# EAGLE design maplemini-r2 (EAGLE 5.11)
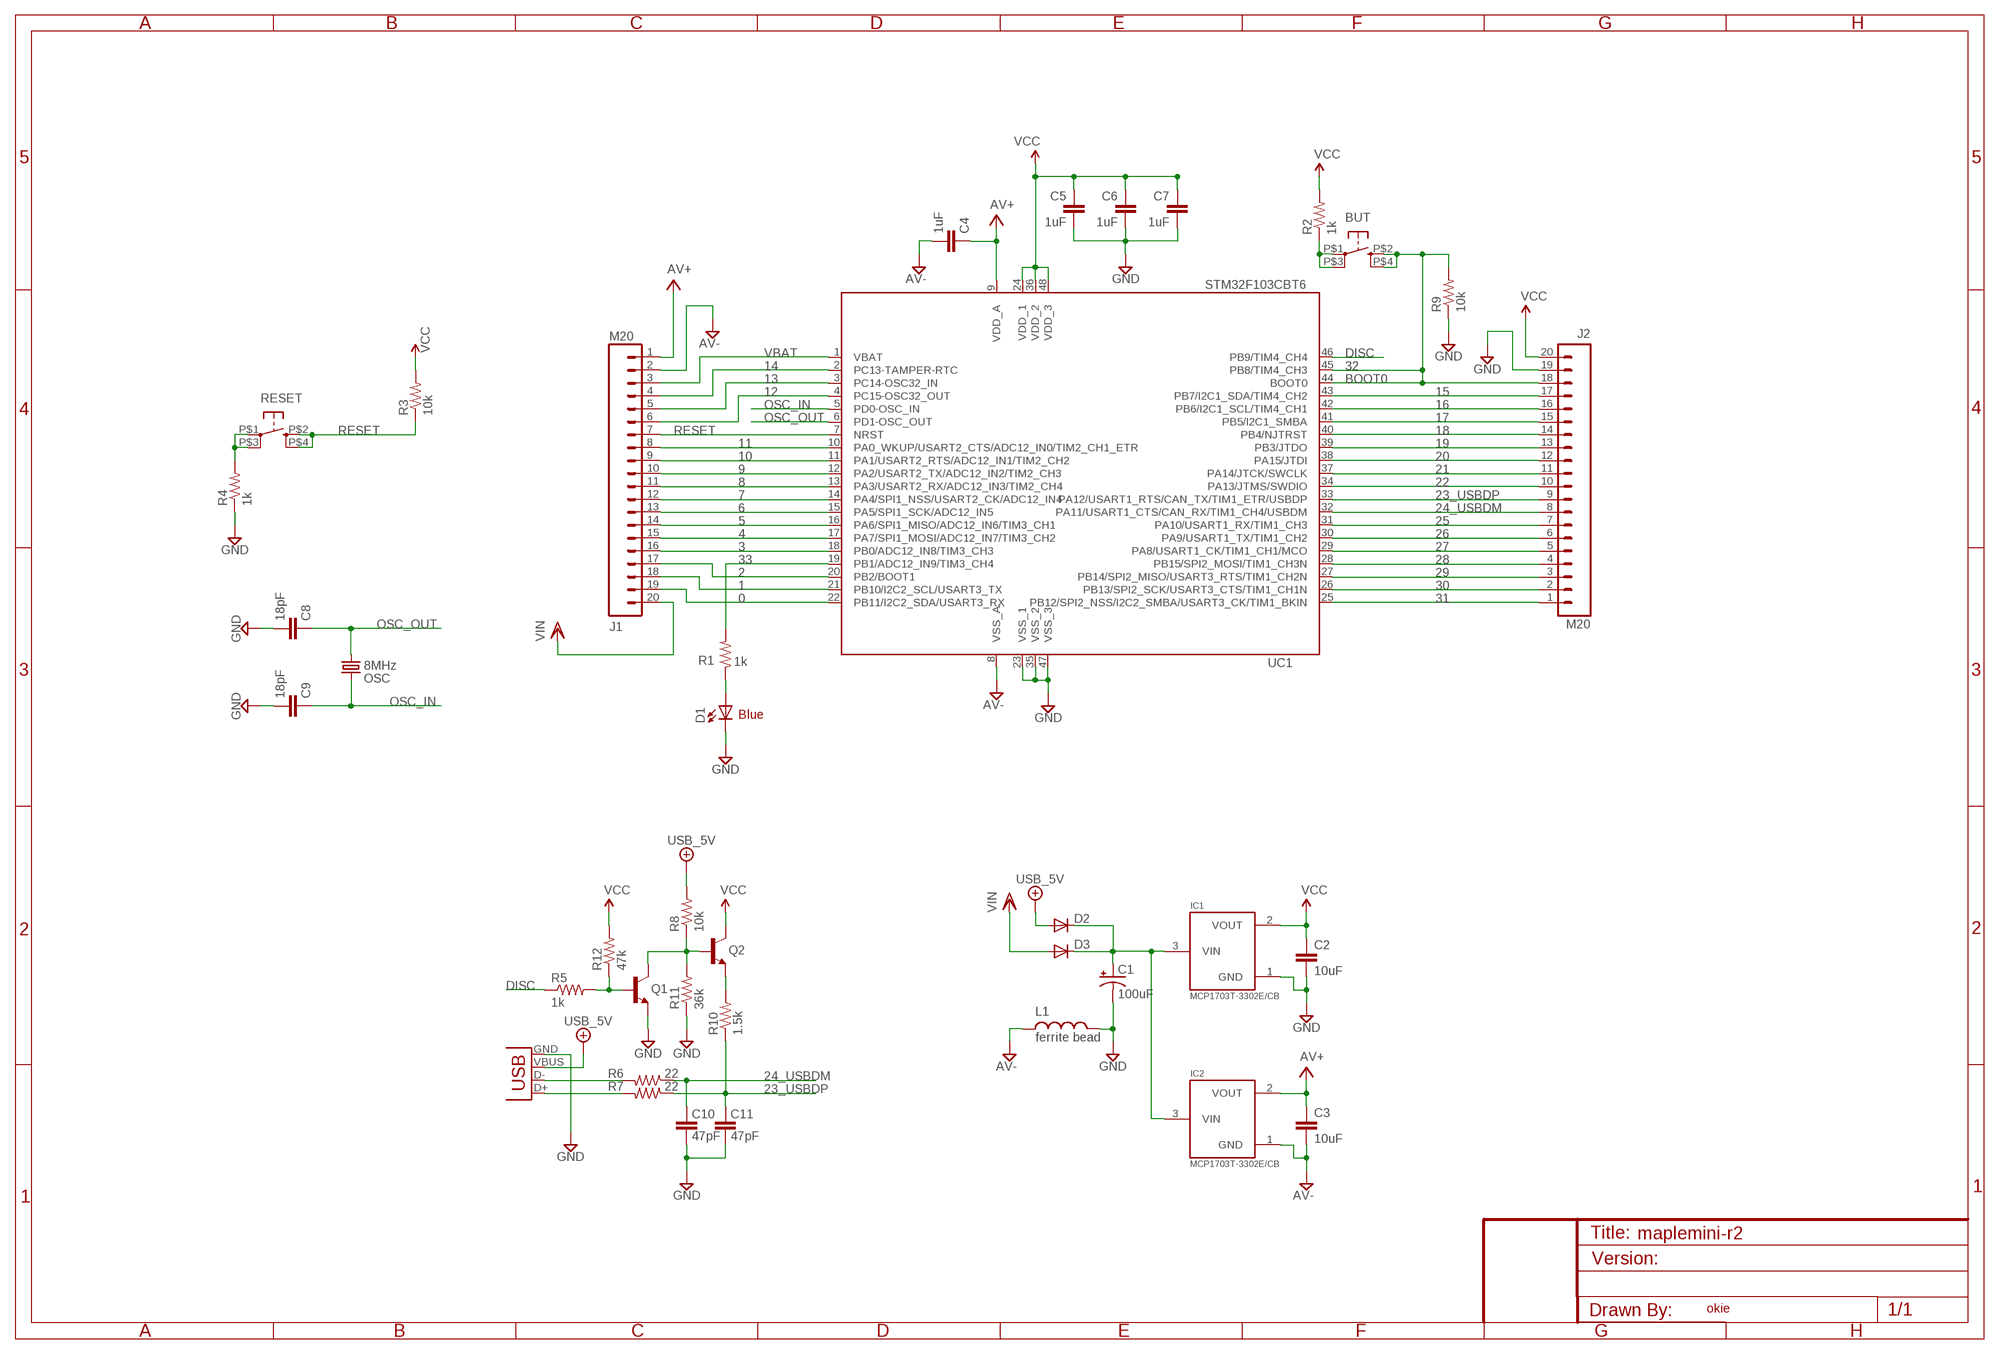
[diagram p0: schematic, sheet 1]

## Parts
BUT  KMR211GLFS  BUTTON-KMR241GLFS  [PUSHBUTTON-KMR241GLFS]
C1  100uF  CAP_POL1206  [EIA3216]
C2  10uF  CAP0805  [0805]
C3  10uF  CAP0805  [0805]
C4  1uF  CAP0402  [C0402]
C5  1uF  CAP0402  [C0402]
C6  1uF  CAP0402  [C0402]
C7  1uF  CAP0402  [C0402]
C8  18pF  CAP0402  [C0402]
C9  18pF  CAP0402  [C0402]
C10  47pF  CAP0402  [C0402]
C11  47pF  CAP0402  [C0402]
D1  Blue  LED1206  [LED-1206]
D2  DIODESOD  [SOD-323]
D3  DIODESOD  [SOD-323]
IC1  MCP1703T-3302E/CB  MCP1700T  [SOT23]
IC2  MCP1703T-3302E/CB  MCP1700T  [SOT23]
J1  M20  [1X20]
J2  M20  [1X20]
L1  ferrite bead  INDUCTOR0603  [0603]
OSC  8MHz  CRYSTAL5X3  [CRYSTAL-SMD-5X3]
Q1  NPN-BJT  TRANSISTOR_NPNSOT23  [SOT23]
Q2  NPN-BJT  TRANSISTOR_NPNSOT23  [SOT23]
R1  1k  RESISTOR0402  [C0402]
R2  1k  RESISTOR0402  [C0402]
R3  10k  RESISTOR0402  [C0402]
R4  1k  RESISTOR0402  [C0402]
R5  1k  RESISTOR0402  [C0402]
R6  22  RESISTOR0402  [C0402]
R7  22  RESISTOR0402  [C0402]
R8  10k  RESISTOR0402  [C0402]
R9  10k  RESISTOR0402  [C0402]
R10  1.5k  RESISTOR0402  [C0402]
R11  36k  RESISTOR0402  [C0402]
R12  47k  RESISTOR0402  [C0402]
RESET  KMR211GLFS  BUTTON-KMR241GLFS  [PUSHBUTTON-KMR241GLFS]
UC1  STM32F103CBT6  STM32F103CB  [LQFP48]
X1  USB-MINIB  USBSMD  [USB-MINIB]

## Nets
0: J1.19 UC1.22(PB11/I2C2_SDA/USART3_RX)
1: J1.18 UC1.21(PB10/I2C2_SCL/USART3_TX)
2: J1.17 UC1.20(PB2/BOOT1)
3: J1.16 UC1.18(PB0/ADC12_IN8/TIM3_CH3)
4: J1.15 UC1.17(PA7/SPI1_MOSI/ADC12_IN7/TIM3_CH2)
5: J1.14 UC1.16(PA6/SPI1_MISO/ADC12_IN6/TIM3_CH1)
6: J1.13 UC1.15(PA5/SPI1_SCK/ADC12_IN5)
7: J1.12 UC1.14(PA4/SPI1_NSS/USART2_CK/ADC12_IN4)
8: J1.11 UC1.13(PA3/USART2_RX/ADC12_IN3/TIM2_CH4)
9: J1.10 UC1.12(PA2/USART2_TX/ADC12_IN2/TIM2_CH3)
10: J1.9 UC1.11(PA1/USART2_RTS/ADC12_IN1/TIM2_CH2)
11: J1.8 UC1.10(PA0_WKUP/USART2_CTS/ADC12_IN0/TIM2_CH1_ETR)
12: J1.6 UC1.4(PC15-OSC32_OUT)
13: J1.5 UC1.3(PC14-OSC32_IN)
14: J1.4 UC1.2(PC13-TAMPER-RTC)
15: J2.17 UC1.43(PB7/I2C1_SDA/TIM4_CH2)
16: J2.16 UC1.42(PB6/I2C1_SCL/TIM4_CH1)
17: J2.15 UC1.41(PB5/I2C1_SMBA)
18: J2.14 UC1.40(PB4/NJTRST)
19: J2.13 UC1.39(PB3/JTDO)
20: J2.12 UC1.38(PA15/JTDI)
21: J2.11 UC1.37(PA14/JTCK/SWCLK)
22: J2.10 UC1.34(PA13/JTMS/SWDIO)
23_USBDP: C11.2 J2.9 R7.1 R10.1 UC1.33(PA12/USART1_RTS/CAN_TX/TIM1_ETR/USBDP)
24_USBDM: C10.2 J2.8 R6.1 UC1.32(PA11/USART1_CTS/CAN_RX/TIM1_CH4/USBDM)
25: J2.7 UC1.31(PA10/USART1_RX/TIM1_CH3)
26: J2.6 UC1.30(PA9/USART1_TX/TIM1_CH2)
27: J2.5 UC1.29(PA8/USART1_CK/TIM1_CH1/MCO)
28: J2.4 UC1.28(PB15/SPI2_MOSI/TIM1_CH3N)
29: J2.3 UC1.27(PB14/SPI2_MISO/USART3_RTS/TIM1_CH2N)
30: J2.2 UC1.26(PB13/SPI2_SCK/USART3_CTS/TIM1_CH1N)
31: J2.1 UC1.25(PB12/SPI2_NSS/I2C2_SMBA/USART3_CK/TIM1_BKIN)
32: BUT.P$2 BUT.P$4 J2.18 R9.2 UC1.44(BOOT0) UC1.45(PB8/TIM4_CH3)
33: R1.2 UC1.19(PB1/ADC12_IN9/TIM3_CH4)
+5V/2: D2.2(A) R8.2 X1.VBUS ; supply symbol labelled USB_5V
AV+: C3.1 C4.1 IC2.2(VOUT) J1.1 UC1.9(VDD_A)
AV-: C3.2 C4.2 IC2.1(GND) J1.2 L1.1 UC1.8(VSS_A)
DGND: C1.C(-) C2.2 C5.2 C6.2 C7.2 C8.2 C9.2 C10.1 C11.1 D1.C IC1.1(GND) J2.19 L1.2 Q1.2(E) R4.1 R9.1 R11.1 UC1.23(VSS_1) UC1.35(VSS_2) UC1.47(VSS_3) X1.GND ; supply symbol labelled GND
DISC: R5.1 UC1.46(PB9/TIM4_CH4)
N$1: BUT.P$1 BUT.P$3 R2.1
N$2: D1.A R1.1
N$4: R4.2 RESET.P$1 RESET.P$3
N$5: C1.A(+) D2.1(C) D3.1(C) IC1.3(VIN) IC2.3(VIN)
N$51: Q2.2(E) R10.2
N$59: R6.2 X1.D-
N$60: R7.2 X1.D+
N$71: Q1.3(C) Q2.1(B) R8.1 R11.2
N$73: Q1.1(B) R5.2 R12.1
OSC_IN: C9.1 OSC.3 UC1.5(PD0-OSC_IN)
OSC_OUT: C8.1 OSC.1 UC1.6(PD1-OSC_OUT)
RESET: J1.7 R3.1 RESET.P$2 RESET.P$4 UC1.7(NRST)
VBAT: J1.3 UC1.1(VBAT)
VCC: C2.1 C5.1 C6.1 C7.1 IC1.2(VOUT) J2.20 Q2.3(C) R2.2 R3.2 R12.2 UC1.24(VDD_1) UC1.36(VDD_2) UC1.48(VDD_3)
VIN: D3.2(A) J1.20

## Notes on the sheet
- BOOT0
- Blue
- okie

## Library data of the parts
BUT RESET = okie:BUTTON-KMR241GLFS
C1 = SparkFun3:CAP_POL: Capacitor Polarized These are standard SMD and PTH capacitors. Normally 10uF, 47uF, and 100uF in electrolytic and tantalum varieties. Always verify the external diameter of the through hole cap, it varies with capacity, voltage, and manufacturer. The EIA devices should be standard.
C2 C3 = SparkFun2:CAP: Capacitor Standard 0603 ceramic capacitor, and 0.1" leaded capacitor.
C4-C11 = SparkFun:CAP: Capacitor Standard 0603 ceramic capacitor, and 0.1" leaded capacitor.
D1 = SparkFun:LED: LEDs Standard schematic elements and footprints for 5mm, 3mm, 1206, and 0603 sized LEDs. 5mm - Spark Fun Electronics SKU : COM-00529 (and others)
D2 D3 = SparkFun3:DIODE: Diode These are standard reverse protection diodes and small signal diodes. SMA package can handle up to about 1A. SOD-323 can handle about 200mA. What the SOD-323 package when ordering, there are some mfgs out there that are 5-pin packages.
IC1 IC2 = okie:MCP1700T
J1 J2 = SparkFun3:M20: This is just like the LOCK variant in that the holes are staggared by 5 mil, but except for the last two holes. They are not altered from the "standard" footprint layout. This is used for a special purpose on the layout of our Graphic LCD Backpack. Make sure you want to use this device before selecting it for you project!
L1 = SparkFun3:INDUCTOR: Inductors Basic Inductor/Choke - 0603 and 1206. Footprints are not proven and vary greatly between part numbers.
OSC = SparkFun2:CRYSTAL: Crystals Various standard crystals. Proven footprints. Spark Fun Electronics SKU : COM-00534
Q1 Q2 = SparkFun2:TRANSISTOR_NPN: Transistor NPN BJT configuration in SOT23 package. MMBT2222 is the common NPN we use. Double check BCE configuration again layout.
R1-R12 = SparkFun:RESISTOR: Resistor Basic schematic elements and footprints for 0603, 1206, and PTH 1/10th watt (small) resistors.
UC1 = stm32:STM32F103CB
X1 = SparkFun2:USB: USB Connectors USB-B-PTH is fully proven SKU : PRT-00139 USB-miniB is fully proven SKU : PRT-00587 USB-A-PCB is untested. USB-A-H is throughly reviewed, but untested. Spark Fun Electronics SKU : PRT-00437 USB-B-SMT is throughly reviewed, but untested. Needs silkscreen touching up. USB-A-S has not been used/tested USB-MB-H has not been used/tested

## Net classes
1 vcc: width 0.254 mm

## Board
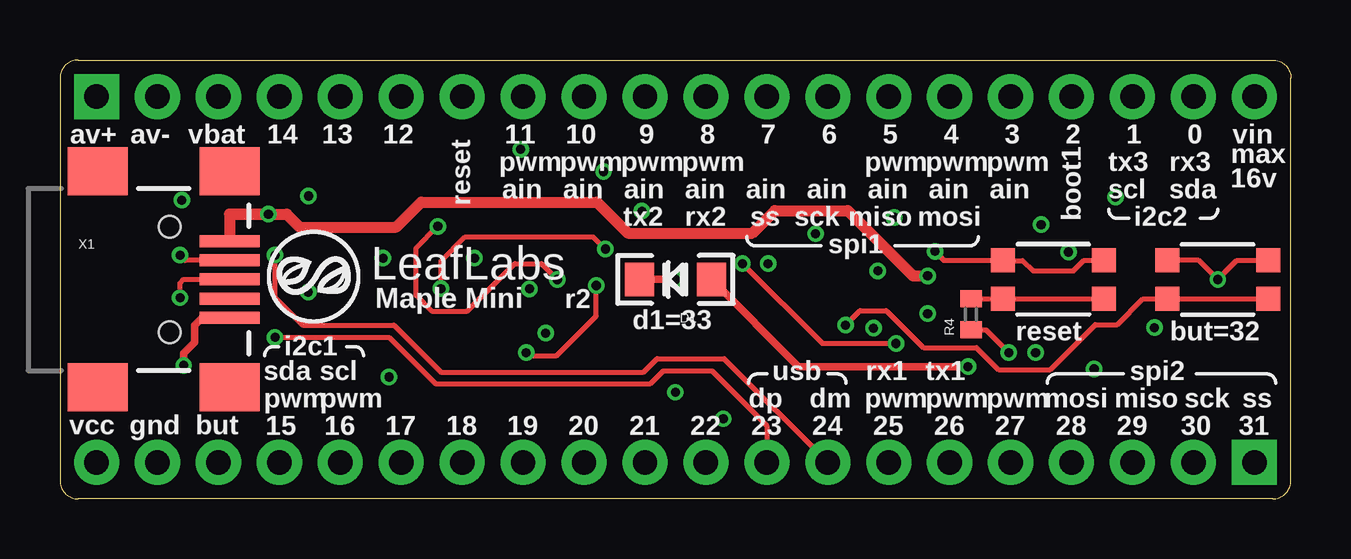
[diagram p1: board, top side]
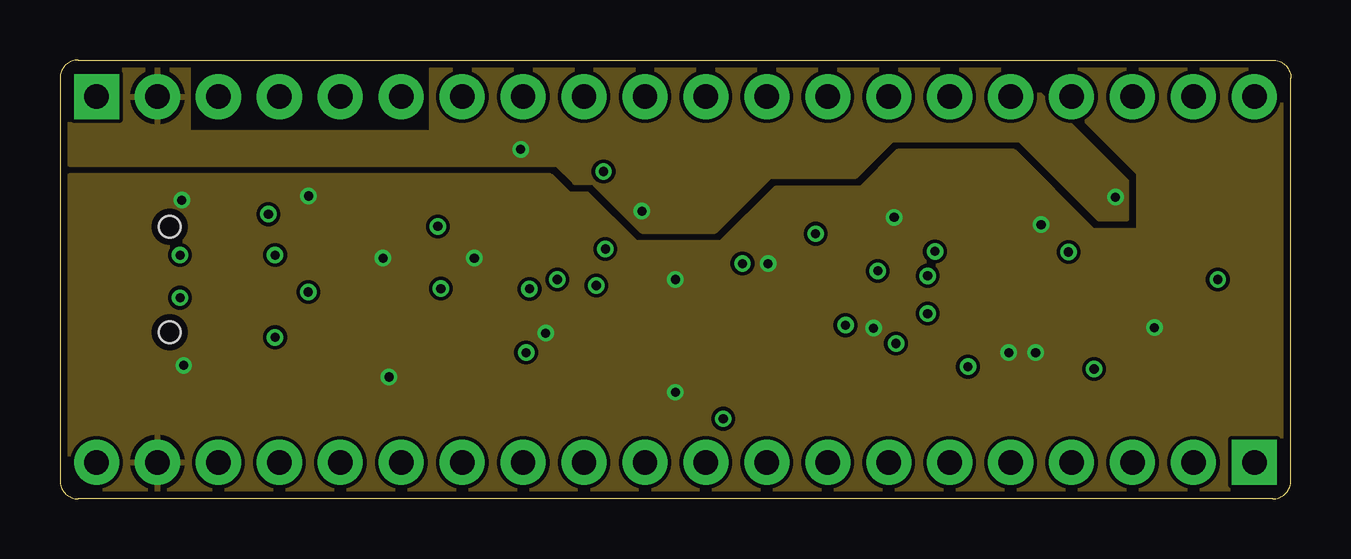
[diagram p2: board, inner layer GND]
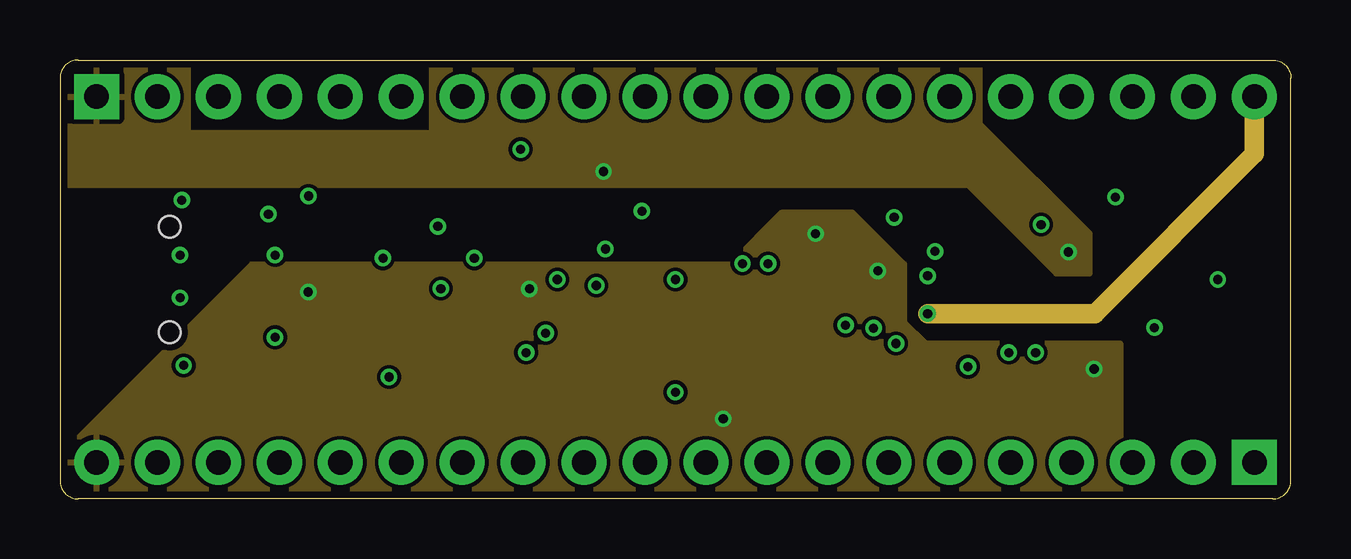
[diagram p3: board, inner layer SUPPLY]
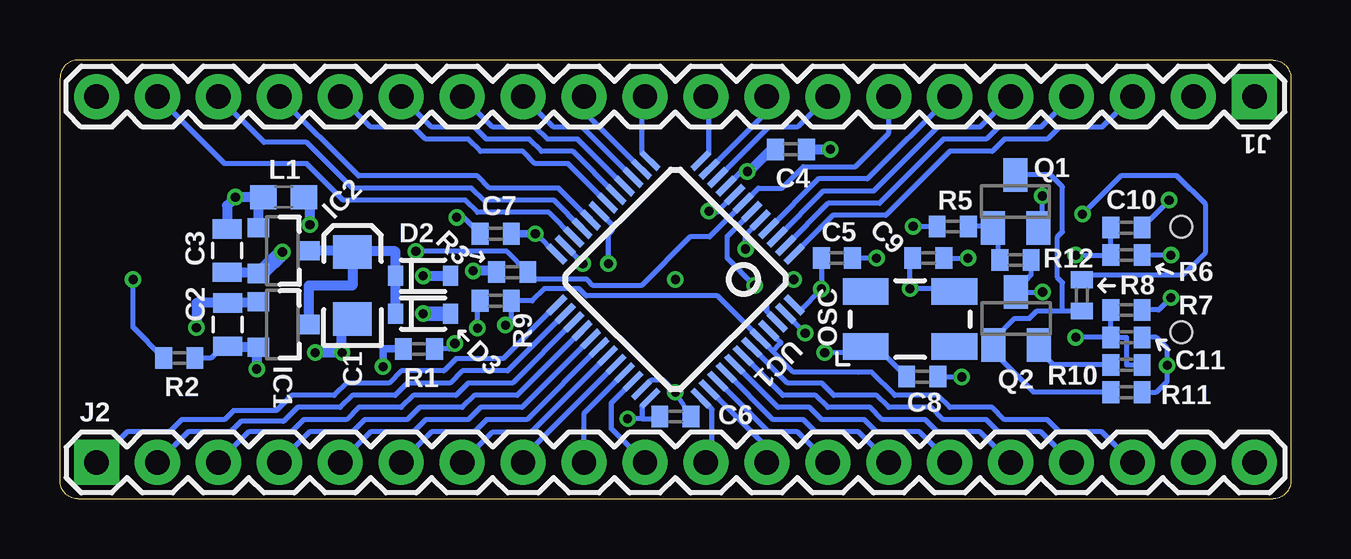
[diagram p4: board, bottom side, seen from below]

Size 51.31 x 18.29 mm. Coordinates in mm from the lower left corner, seen from the top.
Outline: 0.76,18.29 50.55,18.29 arc-90 51.31,17.53 51.31,0.76 arc-90 50.55,0 0.76,0 arc-90 0,0.76 0,17.53 arc-90 0.76,18.29
Copper layers (1*16): Top 0.035mm / dielectric 1.5mm / Bottom 0.035mm
Design rules "default *": minimum track width 6mil, minimum drill 15mil, track to track 6mil, track to pad 6mil, pad to pad 6mil, via to via 6mil, smd to smd 6mil, copper to edge 12mil, drill to drill 15mil, minimum pad ring 6mil, minimum via ring 6mil, stop-mask expansion 0mil, vias tented up to drill 15mil, thermal gap 8mil

### Footprints (pad centres in the part's own frame; a part is rotated, then mirrored left to right if it is on the bottom)
PUSHBUTTON-KMR241GLFS = smd 1 x 1: P$1 2.1,0.8; P$2 2.1,-0.8; P$3 -2.1,0.8; P$4 -2.1,-0.8
EIA3216 = smd 1.4 x 1.6: A 1.4,0; C -1.4,0
0805 = smd 0.8 x 1.2: 1 -0.9,0; 2 0.9,0
C0402 = smd 0.7 x 0.9: 1 -0.65,0; 2 0.65,0
LED-1206 = smd 1.2 x 1.4: A -1.5,0; C 1.5,0
SOD-323 = smd 0.63 x 0.83: 1 -1.15,0; 2 1.15,0
SOT23 = smd 0.8 x 0.9: 1 -0.95,-1; 2 0.95,-1; 3 0,1.1
1X20 = drill 1.016 pad 1.88 square: 1 0,0 | drill 1.016 pad 1.88 round: 2 2.54,0; 3 5.08,0; 4 7.62,0; 5 10.16,0; 6 12.7,0; 7 15.24,0; 8 17.78,0; 9 20.32,0; 10 22.86,0; 11 25.4,0; 12 27.94,0; 13 30.48,0; 14 33.02,0; 15 35.56,0; 16 38.1,0; 17 40.64,0; 18 43.18,0; 19 45.72,0; 20 48.26,0
0603 = smd 1.1 x 1: 1 -0.85,0; 2 0.85,0
CRYSTAL-SMD-5X3 = smd 1.9 x 1.1: 1 -1.85,-1.15; 2 1.85,-1.15; 3 1.85,1.15; 4 -1.85,1.15
SOT23' = smd 1 x 1.4: 1 -0.95,-1.1; 2 0.95,-1.1; 3 0,1.1
LQFP48 = smd 0.254 x 1: 1 -2.75,-4.25; 2 -2.25,-4.25; 3 -1.75,-4.25; 4 -1.25,-4.25; 5 -0.75,-4.25; 6 -0.25,-4.25; 7 0.25,-4.25; 8 0.75,-4.25; 9 1.25,-4.25; 10 1.75,-4.25; 11 2.25,-4.25; 12 2.75,-4.25; 25 2.75,4.25; 26 2.25,4.25; 27 1.75,4.25; 28 1.25,4.25; 29 0.75,4.25; 30 0.25,4.25; 31 -0.25,4.25; 32 -0.75,4.25; 33 -1.25,4.25; 34 -1.75,4.25; 35 -2.25,4.25; 36 -2.75,4.25 | smd 1 x 0.254: 13 4.25,-2.75; 14 4.25,-2.25; 15 4.25,-1.75; 16 4.25,-1.25; 17 4.25,-0.75; 18 4.25,-0.25; 19 4.25,0.25; 20 4.25,0.75; 21 4.25,1.25; 22 4.25,1.75; 23 4.25,2.25; 24 4.25,2.75; 37 -4.25,2.75; 38 -4.25,2.25; 39 -4.25,1.75; 40 -4.25,1.25; 41 -4.25,0.75; 42 -4.25,0.25; 43 -4.25,-0.25; 44 -4.25,-0.75; 45 -4.25,-1.25; 46 -4.25,-1.75; 47 -4.25,-2.25; 48 -4.25,-2.75
USB-MINIB = smd 2.5 x 0.5: D+ 2.5,0; D- 2.5,0.8; GND 2.5,-1.6; ID 2.5,-0.8; VBUS 2.5,1.6 | smd 2.5 x 2: GND@1 -3,-4.5; GND@2 -3,4.5; GND@3 2.5,4.5; GND@4 2.5,-4.5 | hole 0.9: 0,2.2; 0,-2.2

### Placement (x,y rotation side)
BUT  48.26,9.14 0 top
C1  39.12,8.89 90 bottom
C2  44.32,7.26 90 bottom
C3  44.34,10.35 90 bottom
C4  20.84,14.57 0 bottom
C5  18.92,10.03 0 bottom
C6  25.65,3.43 0 bottom
C7  33.15,11.05 180 bottom
C8  15.37,5.09 0 bottom
C9  15.11,10.03 0 bottom
C10  6.86,11.3 180 bottom
C11  6.86,6.73 180 bottom
D1  25.65,9.14 180 top
D2  36.17,9.3 0 bottom
D3  36.17,7.72 0 bottom
IC1  42.04,7.26 270 bottom
IC2  42.04,10.34 270 bottom
J1  1.52,16.76 180 bottom
J2  49.78,1.52 0 bottom
L1  41.99,12.57 0 bottom
OSC  15.88,7.49 0 bottom
Q1  NPN-BJT  [SOT23']  11.48,12.4 0 bottom
Q2  NPN-BJT  [SOT23']  11.46,7.52 0 bottom
R1  36.35,6.25 0 bottom
R2  46.33,5.87 0 bottom
R3  32.46,9.45 180 bottom
R4  37.97,7.7 90 top
R5  14.1,11.35 0 bottom
R6  6.86,10.16 0 bottom
R7  6.86,7.87 0 bottom
R8  8.71,8.48 90 bottom
R9  33.15,8.26 0 bottom
R10  6.86,5.59 180 bottom
R11  6.86,4.45 180 bottom
R12  11.48,9.96 0 bottom
RESET  41.4,9.14 180 top
UC1  25.65,9.14 135 bottom
X1  4.57,9.14 0 top

### Tracks (layer width: path | path; a pad name or v marks a point on that pad's centre or on a via)
0
  Bottom 0.203: UC1.22 30.92,11.94 33.91,11.94 34.42,12.45 39.5,12.45 41.02,13.97 44.45,13.97 J1.19
1
  Bottom 0.203: UC1.21 30.72,12.45 33.66,12.45 34.16,12.95 39.12,12.95 41.02,14.86 42.8,14.86 J1.18
2
  Bottom 0.203: UC1.20 30.52,12.95 33.4,12.95 33.91,13.46 38.86,13.46 J1.17
3
  Bottom 0.203: J1.16 38.35,15.49 36.58,15.49 36.07,14.99 34.29,14.99 33.78,14.48 32,14.48 31.5,13.97 30.13,13.97 UC1.18
4
  Bottom 0.203: J1.15 35.81,15.49 34.04,15.49 33.53,14.99 31.75,14.99 31.24,14.48 29.93,14.48 UC1.17
5
  Bottom 0.203: J1.14 33.27,15.49 31.5,15.49 30.99,14.99 29.73,14.99 UC1.16
6
  Bottom 0.203: J1.13 30.73,15.49 29.53,15.49 UC1.15
7
  Bottom 0.203: UC1.14 29.46,16.14 J1.12
8
  Bottom 0.203: J1.11 27.05,16.64 27.05,14.43 UC1.13
9
  Bottom 0.203: J1.10 24.26,16.64 24.26,14.43 UC1.12
10
  Bottom 0.203: UC1.11 21.84,16.14 J1.9
11
  Bottom 0.203: UC1.10 21.78,15.49 20.57,15.49 J1.8
12
  Bottom 0.203: J1.6 17.65,13.34 19.7,13.34 UC1.4
13
  Bottom 0.203: UC1.3 19.5,12.83 17.4,12.83 14.73,15.49 12.95,15.49 J1.5
14
  Bottom 0.203: UC1.2 19.3,12.32 17.14,12.32 14.48,14.99 12.7,14.99 12.19,15.49 10.41,15.49 J1.4
15
  Bottom 0.203: UC1.43 20.98,4.83 19.56,4.83 19.05,4.32 17.27,4.32 16.76,3.81 14.99,3.81 14.48,3.3 12.7,3.3 12.19,2.79 10.41,2.79 J2.17
16
  Bottom 0.203: UC1.42 21.18,4.32 19.81,4.32 19.3,3.81 17.53,3.81 17.02,3.3 15.24,3.3 14.73,2.79 12.95,2.79 J2.16
17
  Bottom 0.203: UC1.41 21.38,3.81 20.07,3.81 19.56,3.3 17.78,3.3 17.27,2.79 15.49,2.79 J2.15
18
  Bottom 0.203: UC1.40 21.58,3.3 20.32,3.3 19.81,2.79 18.03,2.79 J2.14
19
  Bottom 0.203: UC1.39 21.78,2.79 20.57,2.79 J2.13
20
  Bottom 0.203: UC1.38 21.84,2.15 J2.12
21
  Bottom 0.203: J2.11 24.26,1.65 24.13,1.65 24.13,3.73 UC1.37
22
  Bottom 0.203: J2.10 28.32,2.92 28.32,4 UC1.34
23_USBDP  (via drill 0.38)
  Top 0.203: v8.97,6.73 13.72,6.73 15.65,4.8 24.61,4.8 25.15,5.33 27.18,5.33 29.46,3.05 J2.9
  Bottom 0.203: UC1.33 29.46,3.57 J2.9 | C11.2 v8.97,6.73 | R10.1 6.86,5.59 6.86,6.73 C11.2 | C11.2 R7.1
24_USBDM  (via drill 0.38)
  Top 0.203: v8.97,10.16 8.97,8.38 10.11,7.24 13.92,7.24 15.88,5.28 24.33,5.28 24.89,5.84 27.69,5.84 J2.8
  Bottom 0.203: UC1.32 32,1.73 J2.8 | v8.97,10.16 R6.1 C10.2
25
  Bottom 0.203: UC1.31 31.65,2.79 33.27,2.79 J2.7
26
  Bottom 0.203: UC1.30 31.85,3.3 33.53,3.3 34.04,2.79 35.81,2.79 J2.6
27
  Bottom 0.203: UC1.29 32.05,3.81 33.78,3.81 34.29,3.3 36.07,3.3 36.58,2.79 38.35,2.79 J2.5
28
  Bottom 0.203: UC1.28 32.25,4.32 34.04,4.32 34.54,3.81 36.32,3.81 36.83,3.3 38.61,3.3 39.12,2.79 40.89,2.79 J2.4
29
  Bottom 0.203: UC1.27 32.45,4.83 34.29,4.83 34.8,4.32 36.58,4.32 37.08,3.81 38.86,3.81 39.37,3.3 41.15,3.3 41.66,2.79 43.43,2.79 J2.3
30
  Bottom 0.203: UC1.26 32.65,5.33 34.54,5.33 35.05,4.83 36.83,4.83 37.34,4.32 39.12,4.32 39.62,3.81 41.4,3.81 41.99,3.23 43.76,3.23 44.2,2.79 45.97,2.79 J2.2
31
  Bottom 0.203: UC1.25 32.84,5.84 34.8,5.84 35.31,5.33 37.08,5.33 37.59,4.83 39.37,4.83 39.88,4.32 41.66,4.32 42.29,3.68 44.07,3.68 44.45,3.3 46.23,3.3 46.74,2.79 48.51,2.79 J2.1
32  (via drill 0.38)
  Top 0.203: v32.74,7.24 33.35,7.85 34.44,7.85 35.99,6.3 38.2,6.3 39.12,5.38 41.27,5.38 43.16,7.26 44.07,7.26 45.14,8.33 46.15,8.33 BUT.P$4 BUT.P$2
  Bottom 0.203: 21.6,6.15 UC1.44 23.91,8.46 29.38,8.46 29.68,8.76 31.11,8.76 31.62,8.26 R9.2 32.5,7.48 v32.74,7.24 | J2.18 7.87,2.79 9.65,2.79 10.16,3.3 11.94,3.3 12.45,3.81 14.22,3.81 14.73,4.32 16.51,4.32 17.48,5.28 18.03,5.28 | 21.27,6.48 | 21.6,6.15 21.27,6.48 | UC1.45 21.27,6.53 21.27,6.48 | 18.03,5.28 18.01,5.28 | 21.6,6.15 20.73,5.28 18.03,5.28
33  (via drill 0.38)
  Top 0.203: v28.45,9.8 31.77,6.48 v34.85,6.48
  Bottom 0.203: UC1.19 28.3,11.43 28.3,11.18 28.45,11.02 v28.45,9.8 | v34.85,6.48 35.08,6.25 R1.2
+5V/2  (via drill 0.38)
  Top 0.305: 36.13,9.27 36.12,9.28 v36.17,9.3
  Top 0.457: v8.69,11.86 7.07,11.86 | 7.07,11.86 X1.VBUS | 7.07,11.86 9.45,11.86 9.98,11.33 14.02,11.33 15.06,12.37 22.38,12.37 23.67,11.07 28.85,11.07 29.79,12.01 32.84,12.01 35.56,9.3 v36.17,9.3
  Bottom 0.203: R8.2 8.52,9.32 4.52,9.32 3.56,10.29 3.56,12.27 4.75,13.46 7.09,13.46 v8.69,11.86
  Bottom 0.406: v36.17,9.3 D2.2
AV+  (via drill 0.38)
  Bottom 0.203: UC1.9 22.93,13.64 v22.66,13.64
  Bottom 0.406: C3.1 44.34,9.42 43.04,9.42 | IC2.2 43.04,9.42 | 43.04,9.42 42.9,9.42 | v22.66,13.64 22.58,13.64 21.65,14.57 C4.1
  Bottom 0.66: 42.9,9.42 v42.04,10.29
  pour SUPPLY: 0,18.29 0,13.08 37.85,13.08 41.53,9.4 42.93,9.4 42.93,11.05 38.35,15.62 38.35,18.29 15.49,18.29 15.49,15.24 5.33,15.24 5.33,18.29
AV-  (via drill 0.38)
  Bottom 0.203: UC1.8 23.9,11.96 v24.26,11.99
  Bottom 0.406: C3.2 44.35,12.22 v43.99,12.57 L1.1 42.96,12.45 43.05,12.45 43.05,11.31 IC2.1 43.04,11.25 | C4.2 | C4.2 v19.2,14.57
  pour GND: 43.31,11.68 44.45,11.68 44.45,13.21 39.75,17.91 15.49,17.91 15.49,15.24 5.33,15.24 5.33,18.16 0.38,18.16 0.38,13.97 20.7,13.97 21.46,13.21 22.23,13.21 24.26,11.18 27.3,11.18 29.59,13.46 33.15,13.46 34.67,14.99 40.01,14.99
DGND  (via drill 0.38)
  Top 0.203: R4.1 38.6,7.05 v39.55,6.1
  Top 0.305: X1.GND 5.92,7.54 5.61,7.24 5.61,6.53 5.16,6.07 v5.16,5.56 | D1.C v25.65,9.14
  Bottom 0.203: v17.27,10.03 C5.2 | C8.2 13.69,5.08 v13.72,5.08 | C6.2 v25.65,4.45 26.16,4.95 26.66,4.95 UC1.35 | R9.1 33.91,8.4 v33.91,7.11 | UC1.23 29.5,9.8 v29.52,9.8 | C7.2 34.48,11.73 v34.77,11.73 | Q1.2 10.36,11.46 v10.36,12.62 | UC1.47 20.32,6.99 v20.24,6.91 | C9.2 v13.46,10.03 | C10.1 5.08,12.43 v5.08,12.45 | C11.1 5.61,6.73 5.16,6.27 v5.16,5.56 5.16,4.9 5.61,4.45 R11.1
  Bottom 0.406: IC1.1 43.07,8.18 44.31,8.18 C2.2 45.62,8.16 v45.62,7.14 | C1.C 39.57,7.03 39.57,6.12 v39.55,6.1 40.69,6.1 | L1.2 40.89,12.33 v40.89,11.43
  other vias: 40.67,6.1
  pour GND: 0.38,0.38 50.93,0.38 50.93,17.91 40.64,17.91 44.96,13.59 44.96,11.18 43.05,11.18 39.75,14.48 34.92,14.48 33.4,12.95 29.84,12.95 27.56,10.67 24,10.67 21.97,12.7 21.21,12.7 20.45,13.46 0.38,13.46
DISC  (via drill 0.38)
  Top 0.203: v20.73,9.14 20.07,9.8 18.95,9.8 16.97,7.82 15.49,7.82 14.83,8.48 14.83,10.44 v15.75,11.35
  Bottom 0.203: 14.75,11.54 R5.1 v15.75,11.35 | UC1.46 21.87,7.83 21.87,8.2 20.93,9.14 v20.73,9.14
N$1  (via drill 0.38)
  Top 0.203: BUT.P$3 47.46,9.94 v48.26,9.14 49.06,9.94 BUT.P$1
  Bottom 0.203: R2.1 48.26,7.15 v48.26,9.14
N$2  (via drill 0.38)
  Top 0.305: D1.A 30.79,5.51 v37.85,5.51
  Bottom 0.305: R1.1 37.85,6.25 v37.85,5.51
N$4
  Top 0.203: R4.2 RESET.P$1 RESET.P$3
N$5
  Bottom 0.406: D3.1 37.29,7.75 37.32,7.78 D2.1 37.32,10.31 39.12,10.31 C1.A | IC2.3 39.12,10.34 C1.A | IC1.3 40.94,8.89 39.12,8.89 39.12,10.26 | C1.A 39.12,10.26 | 39.12,10.26 39.06,10.26
N$51
  Bottom 0.203: 10.24,6.71 Q2.2 10.11,6.02 10.11,5.79 9.91,5.59 R10.2
N$59  (via drill 0.38)
  Top 0.203: v5,10.16 5.22,9.94 X1.D-
  Bottom 0.203: v5,10.16 R6.2
N$60  (via drill 0.38)
  Top 0.203: X1.D+ 5.16,9.14 5,8.99 v5,8.38
  Bottom 0.203: R7.2 5.51,7.87 v5,8.38
N$71
  Bottom 0.203: R11.2 10.72,4.45 12.09,5.82 12.09,6.1 Q2.1 12.4,6.62 11.51,7.52 10.9,7.52 10.58,7.83 9.47,7.83 | 9.47,7.83 R8.1 | 9.47,7.83 9.53,7.83 9.53,9.02 9.73,9.22 9.73,10.92 9.53,11.12 9.53,13.01 10.03,13.51 11.46,13.51 Q1.3
N$73
  Bottom 0.203: R12.1 12.16,9.93 12.19,9.93 12.19,11.06 Q1.1 12.49,11.35 R5.2
OSC_IN  (via drill 0.38)
  Top 0.203: v22.73,10.41 22.23,10.92 16.89,10.92 15.88,9.91 v15.88,8.76
  Bottom 0.203: 13.69,8.64 13.69,8.81 13.85,8.81 OSC.3 14.61,8.64 14.73,8.76 v15.88,8.76 15.88,9.92 C9.1 | UC1.5 22.73,11 v22.73,10.41
OSC_OUT  (via drill 0.38)
  Top 0.203: v22.35,8.89 22.35,7.62 20.7,5.97 19.56,5.97 v19.43,6.1
  Bottom 0.203: OSC.1 18.11,6.73 | UC1.6 23.5,10.95 23.5,10.03 v22.35,8.89 | v19.43,6.1 17.97,6.1 OSC.1 | OSC.1 17.27,6.34 C8.1
RESET  (via drill 0.38)
  Top 0.203: v36.47,10.31 36.84,9.94 RESET.P$2 39.31,9.93 40.13,9.93 40.56,9.5 42.24,9.5 42.69,9.94 RESET.P$4
  Bottom 0.203: J1.7 16.76,15.24 18.16,13.84 20.32,13.84 21.21,12.95 22.2,12.95 UC1.7 24.23,10.92 25.04,10.92 27.08,8.89 29.08,8.89 29.34,9.14 31.83,9.14 31.8,9.17 31.8,9.44 R3.1 32.67,10.31 v36.47,10.31
VBAT
  Bottom 0.203: UC1.1 19.1,11.81 16.89,11.81 14.22,14.48 12.45,14.48 11.94,14.99 10.16,14.99 9.65,15.49 7.87,15.49 J1.3
VCC  (via drill 0.38)
  Bottom 0.203: 26.37,3.37 C6.1 26.39,3.34 27.05,3.34 | C5.1 19.6,9.99 | R12.2 10.83,9.34 11.07,9.09 11.07,9.02 11.47,8.62 | 11.47,8.62 Q2.3 | UC1.24 31.45,11.05 v31.5,11.05 | 27.65,3.26 v27.65,3.34 27.05,3.34 | UC1.36 27.05,3.86 27.05,3.34 | C5.1 19.57,10.02 | UC1.48 20.47,7.85 v19.57,8.75 C5.1 | 11.47,8.62 v10.36,8.62 v10.35,8.62 | R2.2 45.01,5.87 44.81,6.07 44.62,6.07 C2.1
  Bottom 0.305: 32.51,11.05 C7.1 v31.5,11.05
  Bottom 0.406: C2.1 44.32,6.33 43.1,6.33 | 43.1,6.33 43.04,6.33 IC1.2 42.96,6.31 | 43.1,6.33 v43.1,5.41 | R3.2 33.16,9.5 v34.09,9.5
  pour SUPPLY: 44.2,6.48 44.2,0 0,0 0,1.78 8,9.78 27.94,9.78 30.1,11.94 33.02,11.94 35.18,9.78 35.18,7.37 36.07,6.48
VIN  (via drill 0.38)
  SUPPLY 0.813: J1.20 49.78,14.38 43.13,7.72 v36.17,7.72
  Bottom 0.61: D3.2 v36.17,7.72

### Text on the board
_tsilk: av+ | av- | vbat | 14 | 13 | 12 | 11 | 10 | 9 | 8 | 7 | 6 | 5 | 4 | 3 | boot1 | 2 | 1 | 0 | vin | pwm | pwm | pwm | pwm | pwm | pwm | pwm | tx3 | rx3 | max | ain | ain | ain | ain | ain | ain | ain | ain | ain | scl | sda | 16v | reset | tx2 | rx2 | ss | sck | miso | mosi | i2c2 | spi1 | LeafLabs | Maple Mini | r2 | d1=33 | reset | but=32 | i2c1 | sda | scl | usb | rx1 | tx1 | spi2 | pwm | pwm | dp | dm | pwm | pwm | pwm | mosi | miso | sck | ss | vcc | gnd | but | 15 | 16 | 17 | 18 | 19 | 20 | 21 | 22 | 23 | 24 | 25 | 26 | 27 | 28 | 29 | 30 | 31